# EAGLE design large_sense_pcb_d (EAGLE 9.6.2)
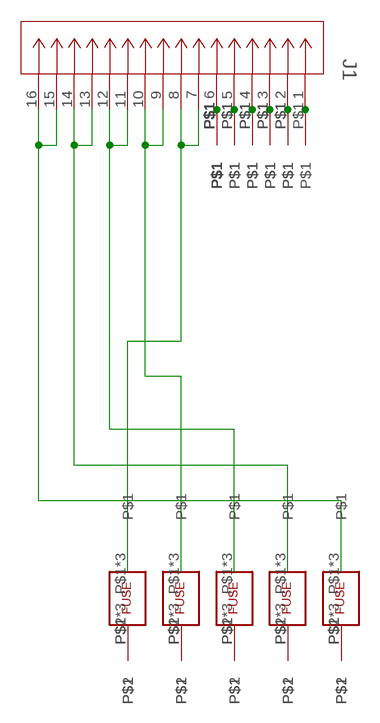
[diagram p0: schematic, sheet 1]

## Parts
J1  DF11-16DP-2DSA(01)  [CONN_DF11-16DP-2DSA(01)_HIR]
U$1  FUSE  [FUSE_PADS]
U$2  FUSE  [FUSE_PADS]
U$3  FUSE  [FUSE_PADS]
U$4  FUSE  [FUSE_PADS]
U$5  FUSE  [FUSE_PADS]
U$6  BB_CONTACT  [BB_CONTACT]
U$7  BB_CONTACT  [BB_CONTACT]
U$8  BB_CONTACT  [BB_CONTACT]
U$9  BB_CONTACT  [BB_CONTACT]
U$10  BB_CONTACT  [BB_CONTACT]
U$12  THERM_PIN  [THERM_PIN]
U$13  THERM_PIN  [THERM_PIN]
U$14  THERM_PIN  [THERM_PIN]
U$15  THERM_PIN  [THERM_PIN]
U$16  THERM_PIN  [THERM_PIN]
U$17  THERM_PIN  [THERM_PIN]
U$18  THERM_PIN  [THERM_PIN]
U$19  THERM_PIN  [THERM_PIN]
U$20  THERM_PIN  [THERM_PIN]
U$22  THERM_PIN  [THERM_PIN]
U$23  THERM_PIN  [THERM_PIN]
U$24  THERM_PIN  [THERM_PIN]
U$25  THERM_PIN  [THERM_PIN]
U$26  THERM_PIN  [THERM_PIN]
U$27  THERM_PIN  [THERM_PIN]
U$28  THERM_PIN  [THERM_PIN]
U$29  THERM_PIN  [THERM_PIN]
U$30  THERM_PIN  [THERM_PIN]

## Nets
N$1: J1.15 J1.16 U$5.P$1 U$5.P$3 U$5.P$5
N$2: U$1.P$2 U$1.P$4 U$1.P$6 U$6.P$1
N$3: J1.7 J1.8 U$1.P$1 U$1.P$3 U$1.P$5
N$4: U$2.P$2 U$2.P$4 U$2.P$6 U$7.P$1
N$5: U$5.P$2 U$5.P$4 U$5.P$6 U$10.P$1
N$6: U$3.P$2 U$3.P$4 U$3.P$6 U$8.P$1
N$7: J1.13 J1.14 U$4.P$1 U$4.P$3 U$4.P$5
N$8: U$4.P$2 U$4.P$4 U$4.P$6 U$9.P$1
N$9: J1.11 J1.12 U$3.P$1 U$3.P$3 U$3.P$5
N$10: J1.9 J1.10 U$2.P$1 U$2.P$3 U$2.P$5
THERM1: J1.5 U$22.P$1 U$23.P$1
THERM2: J1.4 U$24.P$1 U$25.P$1
THERM3: J1.3 U$26.P$1 U$27.P$1
THERM4: J1.2 U$28.P$1 U$29.P$1
THERM5: J1.1 U$30.P$1
THERMGND: J1.6 U$12.P$1 U$13.P$1 U$14.P$1 U$15.P$1 U$16.P$1 U$17.P$1 U$18.P$1 U$19.P$1 U$20.P$1

## Library data of the parts
J1 = sense_pcb_components:DF11-16DP-2DSA(01); COPYRIGHT: Copyright (C) 2023 Ultra Librarian. All rights reserved.; MANUFACTURER_PART_NUMBER: DF11-16DP-2DSA(01); MFR_NAME: Hirose
U$1-U$5 = sense_pcb_components:FUSE
U$6-U$10 = sense_pcb_components:BB_CONTACT
U$12-U$20 U$22-U$30 = sense_pcb_components:THERM_PIN

## Board
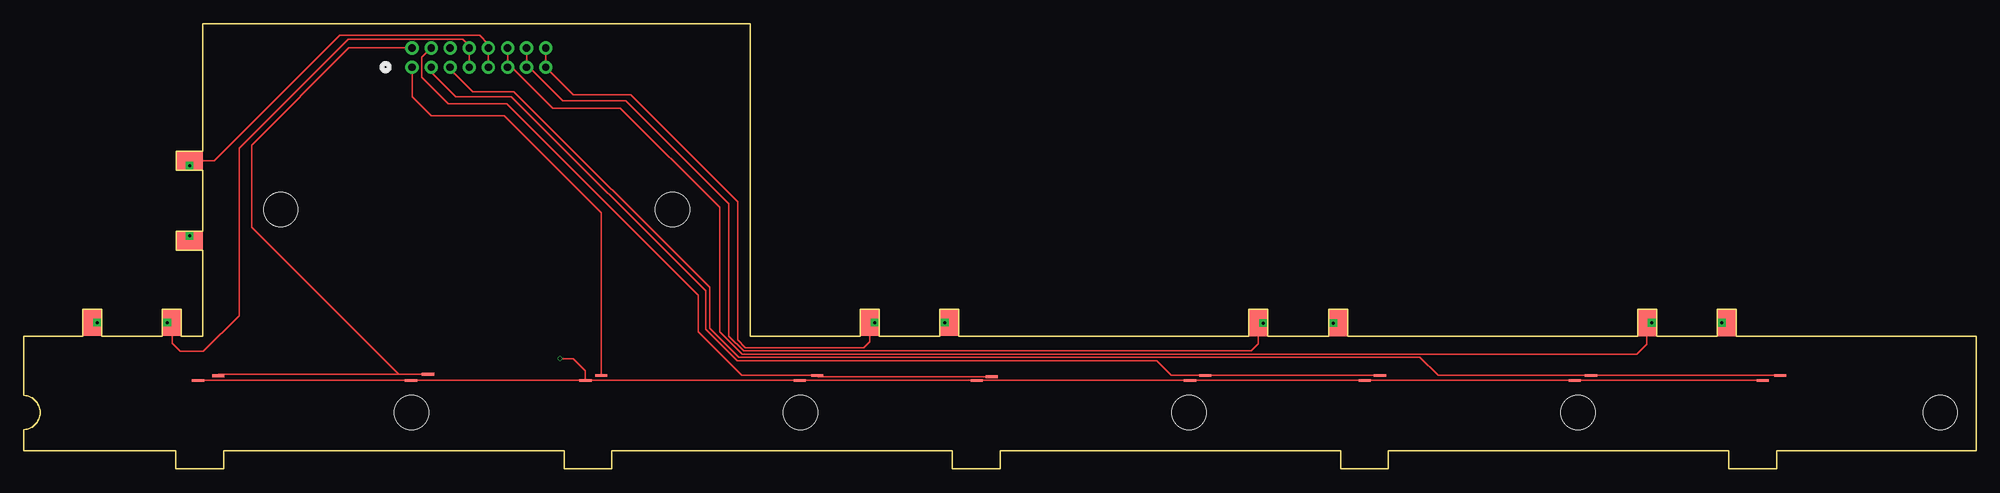
[diagram p1: board, top side]
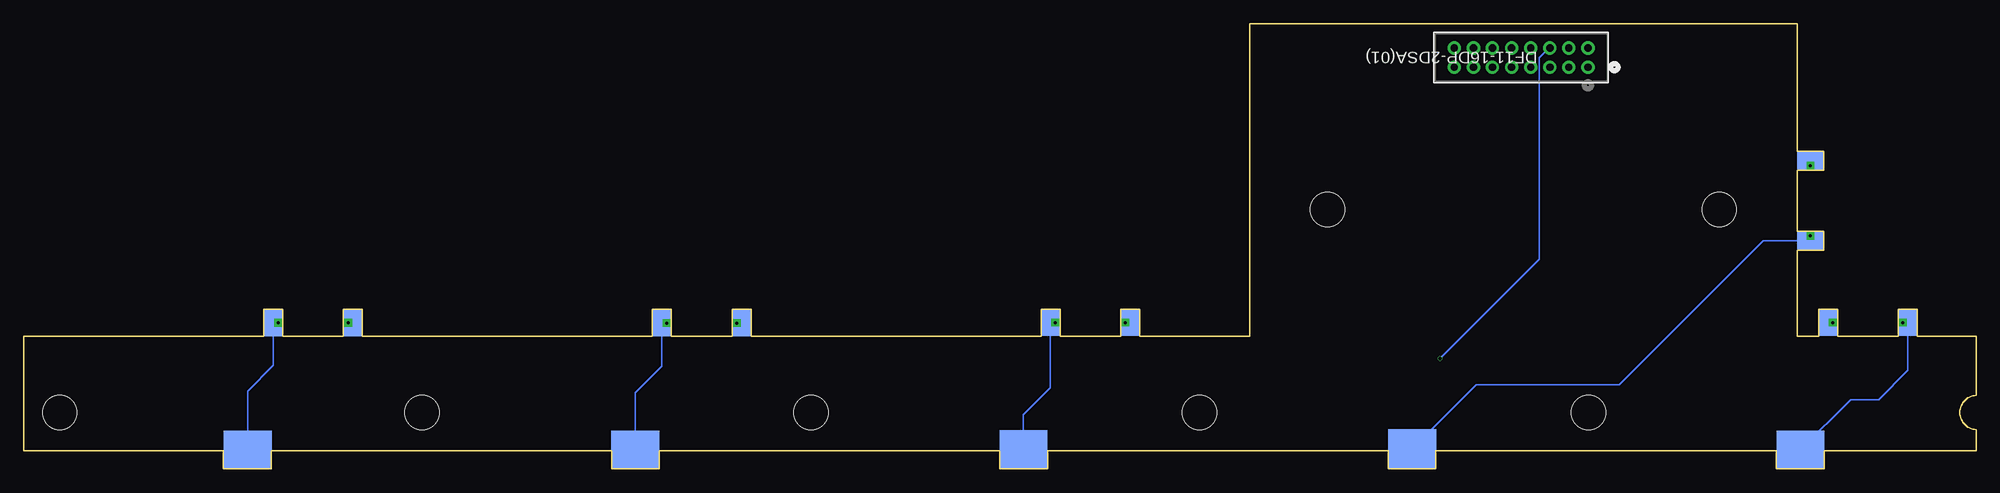
[diagram p2: board, bottom side, seen from below]

Size 204.4 x 46.59 mm. Coordinates in mm from the lower left corner, seen from the top.
Outline: 0,4.1 0,1.9 15.93,1.9 15.93,0 20.93,0 20.93,1.9 56.58,1.9 56.58,0 61.58,0 61.58,1.9 97.23,1.9 97.23,0 102.23,0 102.23,1.9 137.88,1.9 137.88,0 142.88,0 142.88,1.9 178.53,1.9 178.53,0 183.53,0 183.53,1.9 204.4,1.9 204.4,13.9 179.3,13.9 179.3,16.7 177.3,16.7 177.3,13.9 170.95,13.9 170.95,16.7 168.95,16.7 168.95,13.9 138.6,13.9 138.6,16.7 136.6,16.7 136.6,13.9 130.25,13.9 130.25,16.7 128.25,16.7 128.25,13.9 97.9,13.9 97.9,16.7 95.9,16.7 95.9,13.9 89.55,13.9 89.55,16.7 87.55,16.7 87.55,13.9 76.05,13.9 76.05,46.59 18.75,46.59 18.75,33.25 15.95,33.25 15.95,31.25 18.75,31.25 18.75,24.9 15.95,24.9 15.95,22.9 18.75,22.9 18.75,13.9 16.5,13.9 16.5,16.7 14.5,16.7 14.5,13.9 8.15,13.9 8.15,16.7 6.15,16.7 6.15,13.9 0,13.9 0,7.7 arc-174 0,4.1
Copper layers (1*16): Top 0.035mm / dielectric 1.6mm / Bottom 0.035mm
Design rules "jlcpcb-2layers": minimum track width 5mil, minimum drill 0.3mm, track to track 5mil, track to pad 5mil, pad to pad 5mil, via to via 5mil, smd to smd 5mil, copper to edge 0.2mm, drill to drill 6mil, minimum pad ring 10mil, minimum via ring 3mil, stop-mask expansion 4mil, vias tented up to drill 0mil, thermal gap 10mil
Holes 3.6 mm at 40.6,5.9 200.65,5.9 67.9,27.15 162.7,5.9 26.9,27.15 81.3,5.9 122,5.9

### Footprints (pad centres in the part's own frame; a part is rotated, then mirrored left to right if it is on the bottom)
CONN_DF11-16DP-2DSA(01)_HIR = drill 0.762 pad 1.27: 1 0,0; 2 0,-2.007; 3 2.007,0; 4 2.007,-2.007; 5 3.988,0; 6 3.988,-2.007; 7 5.994,0; 8 5.994,-2.007; 9 8.001,0; 10 8.001,-2.007; 11 10.008,0; 12 10.008,-2.007; 13 11.989,0; 14 11.989,-2.007; 15 13.995,0; 16 13.995,-2.007
FUSE_PADS = smd 2.8 x 2 bottom: P$1 0,0; P$2 0,8.35 | smd 2.8 x 2: P$3 0,0; P$4 0,8.35 | drill 0.305 square: P$5 0,0.508; P$6 0,7.842
BB_CONTACT = smd 5 x 4: P$1 0,0
THERM_PIN = smd 0.279 x 1.27: P$1 0,0

### Placement (x,y rotation side)
J1  40.64,42.06 180 bottom
U$1  15.52,15.31 90 top
U$2  17.35,32.25 180 top
U$3  169.93,15.29 270 top
U$4  129.26,15.26 270 top
U$5  88.57,15.31 270 top
U$6  18.39,2 0 bottom
U$7  59.03,2.13 0 bottom
U$8  180.97,1.98 0 bottom
U$9  140.39,2 0 bottom
U$10  99.75,2.03 0 bottom
U$12  182.04,9.27 90 top
U$13  162.38,9.27 90 top
U$14  140.39,9.27 90 top
U$15  122.1,9.27 90 top
U$16  99.77,9.27 90 top
U$17  81.23,9.27 90 top
U$18  58.8,9.27 90 top
U$19  40.54,9.27 90 top
U$20  18.24,9.27 90 top
U$22  183.9,9.77 90 top
U$23  164.08,9.77 90 top
U$24  83.06,9.77 90 top
U$25  101.32,9.65 90 top
U$26  123.7,9.77 90 top
U$27  141.99,9.77 90 top
U$28  20.35,9.75 90 top
U$29  42.32,9.9 270 top
U$30  60.45,9.77 90 top

### Tracks (layer width: path | path; a pad name or v marks a point on that pad's centre or on a via)
N$1
  Top 0.152: J1.16 J1.15 57.53,39.16 63.55,39.16 74.73,27.99 74.73,13.5 75.53,12.7 87.94,12.7 88.57,13.33 U$5.P$3 U$5.P$5
  Bottom 0.152: U$5.P$3 U$5.P$5
N$2
  Top 0.152: U$1.P$4 U$1.P$6
  Bottom 0.152: U$6.P$1 13.13,7.26 10.21,7.26 7.17,10.3 U$1.P$4 7.37,15.31 U$1.P$6
N$3
  Top 0.152: J1.7 J1.8 46.63,44.34 45.97,45 33.98,45 22.53,33.55 22.53,16.02 18.8,12.29 16.36,12.29 15.52,13.13 U$1.P$3 U$1.P$5
  Bottom 0.152: U$1.P$3 U$1.P$5
N$4
  Top 0.152: U$2.P$4 U$2.P$6
  Bottom 0.152: U$7.P$1 52.35,8.81 37.36,8.81 22.27,23.9 U$2.P$4 U$2.P$6
N$5
  Top 0.152: U$5.P$4 U$5.P$6
  Bottom 0.152: U$10.P$1 99.75,5.69 96.92,8.51 U$5.P$4 U$5.P$6
N$6
  Top 0.152: U$3.P$4 U$3.P$6
  Bottom 0.152: U$8.P$1 180.97,8.12 178.28,10.82 U$3.P$4 U$3.P$6
N$7
  Top 0.152: J1.14 J1.13 52.93,42.06 56.44,38.55 63.02,38.55 73.81,27.76 73.81,13.89 75.36,12.34 128.5,12.34 129.26,13.1 U$4.P$3 U$4.P$5
  Bottom 0.152: U$4.P$3 U$4.P$5
N$8
  Top 0.152: U$4.P$4 U$4.P$6
  Bottom 0.152: U$9.P$1 140.39,7.95 137.61,10.72 U$4.P$4 U$4.P$6
N$9
  Top 0.152: J1.12 J1.11 51.08,42.06 55.36,37.78 62.45,37.78 72.86,27.36 72.86,14.36 75.21,12.01 168.88,12.01 169.93,13.05 U$3.P$3 U$3.P$5
  Bottom 0.152: U$3.P$3 U$3.P$5
N$10
  Top 0.152: J1.9 J1.10 48.64,44.48 47.73,45.39 33.05,45.39 19.91,32.25 U$2.P$3 U$2.P$5
  Bottom 0.152: U$2.P$5 17.35,32.13 U$2.P$3
THERM1
  Top 0.152: U$22.P$1 U$23.P$1 148.08,9.77 146.15,11.7 74.83,11.7 71.79,14.74 71.79,19.01 51.31,39.49 46.99,39.49 44.63,41.85 J1.5
THERM2
  Top 0.152: J1.4 41.66,43.07 41.66,41.02 44.45,38.22 50.55,38.22 70.61,18.16 70.61,14.35 75.18,9.77 U$24.P$1 83.19,9.65 U$25.P$1
THERM3
  Top 0.152: J1.3 42.65,41.55 45.21,38.98 51.05,38.98 71.37,18.66 71.37,14.6 74.68,11.3 118.62,11.3 120.14,9.77 U$26.P$1 U$27.P$1
THERM4
  Top 0.152: U$28.P$1 20.34,9.9 U$29.P$1 39.27,9.9 23.88,25.29 23.88,33.9 34.04,44.06 J1.2
THERM5
  Top 0.152: U$30.P$1 60.45,26.79 50.29,36.95 42.67,36.95 40.64,38.98 J1.1
THERMGND  (via drill 0.35)
  Top 0.152: U$20.P$1 U$19.P$1 U$18.P$1 | U$18.P$1 U$17.P$1 U$16.P$1 U$15.P$1 U$14.P$1 U$13.P$1 U$12.P$1 | U$18.P$1 58.8,10.28 57.53,11.55 v56.13,11.55
  Bottom 0.152: v56.13,11.55 45.72,21.97 45.72,43.05 44.7,44.06 J1.6